# EasyEDA Pro project AAR.epro

# Schematic Schematic1
Board Name: Board1; Create Date: 2026-04-26; Page Name: P1; Project Name: AAR; Schematic Name: Schematic1; Update Date: 2026-04-26; Company: EasyEDA.com; Page Size: A4; Version: V1.0
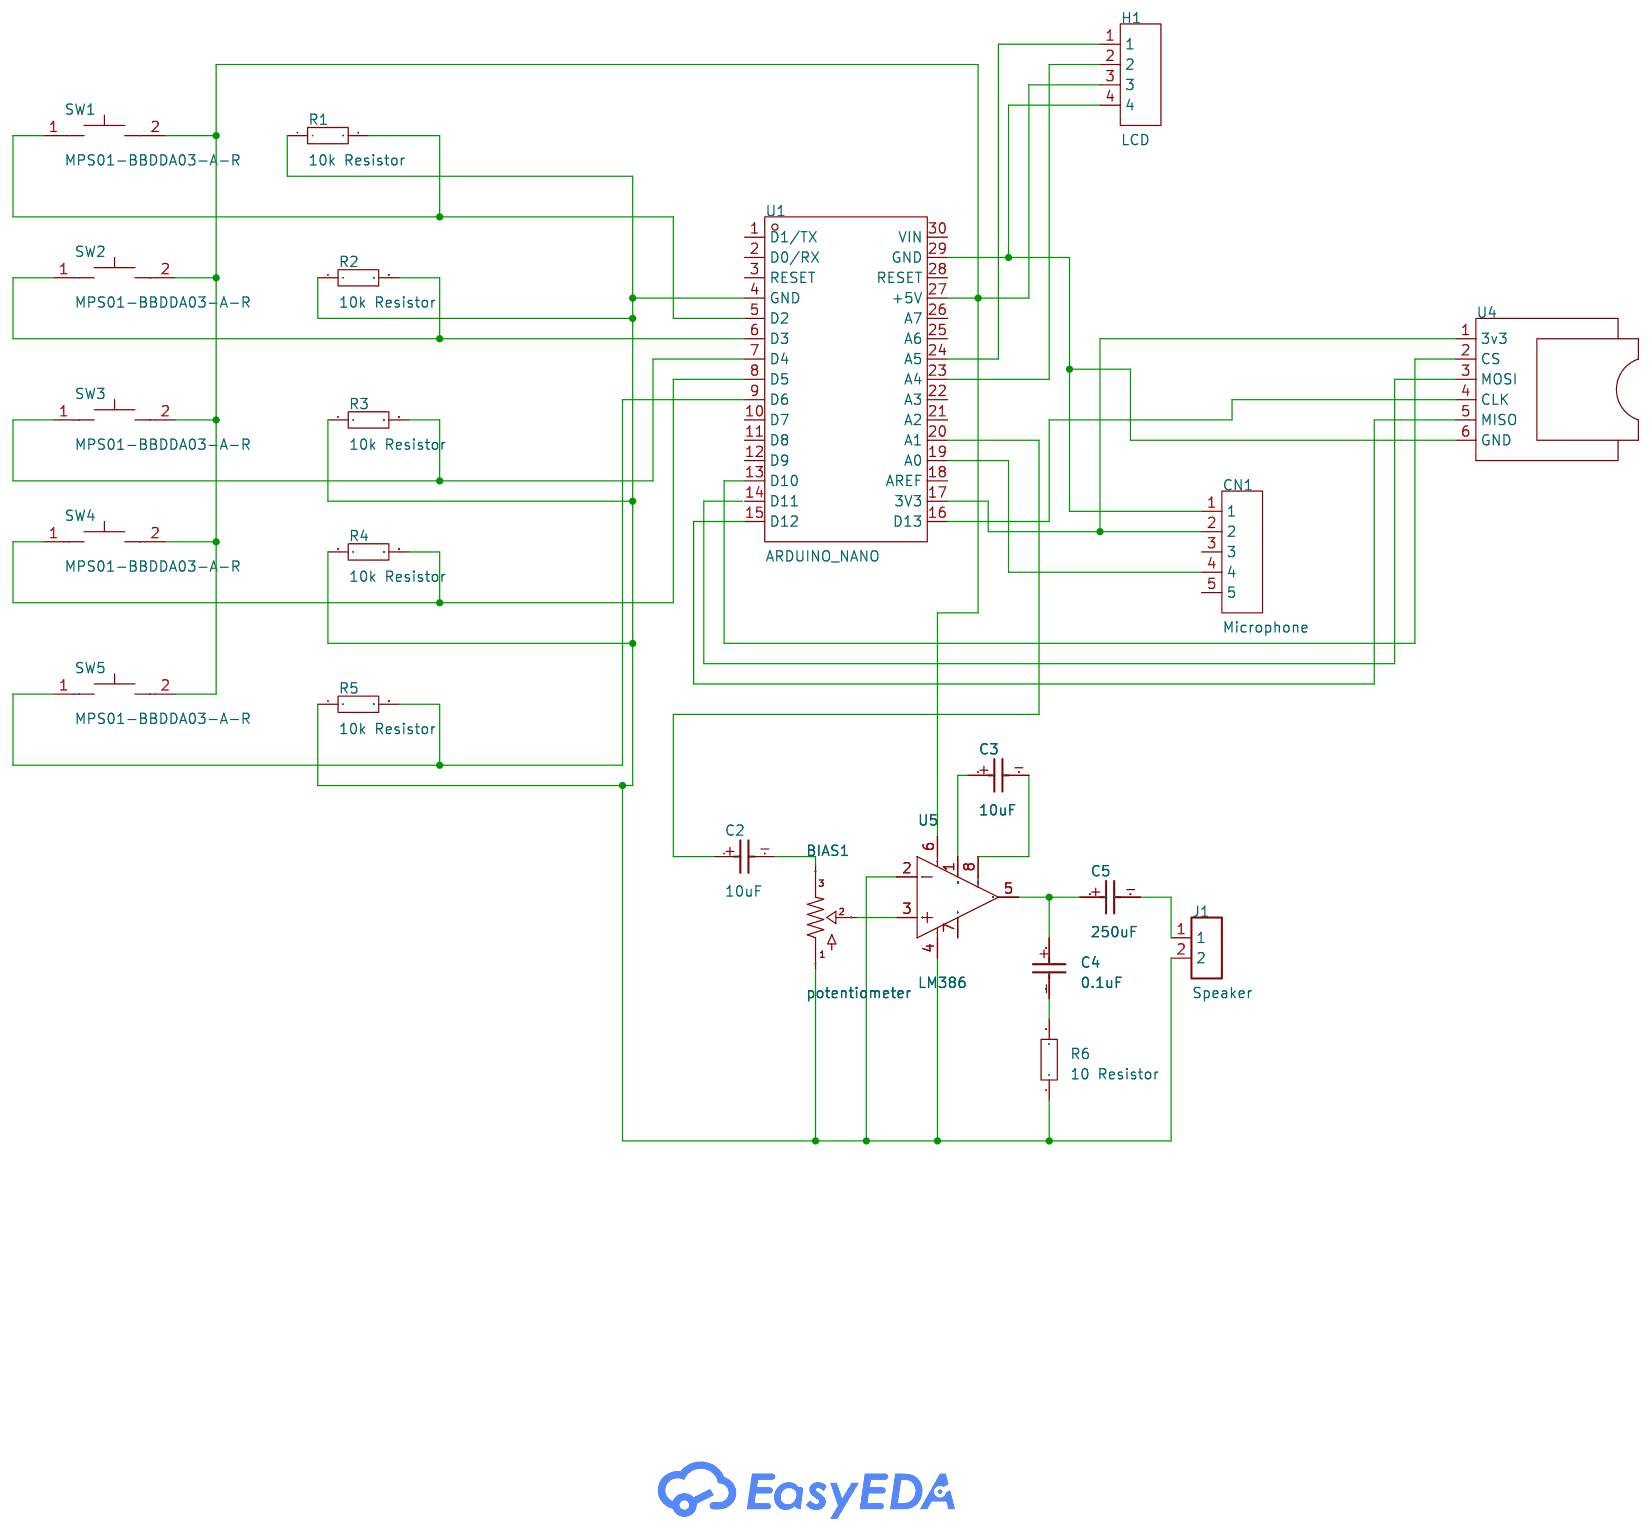
[diagram p0: schematic sheet]

## Parts
BIAS1  potentiometer  [TRIM1]
C2  10uF  [CAP-TH_L7.2-W2.5-P5.00-D0.5_224CL0016]
C3  10uF  [CAP-TH_L7.2-W2.5-P5.00-D0.5_224CL0016]
C4  0.1uF  [CAP-TH_L7.2-W2.5-P5.00-D0.5_224CL0016]
C5  250uF  [CAP-TH_L7.2-W2.5-P5.00-D0.5_224CL0016]
CN1  Microphone  [CONN-TH_5P-P1.25_C9900015777]
H1  LCD  [HDR-SMD_4P-P2.54_POGOPIN]
J1  Speaker  [JST-PH-2.0-2P]
R1  10k Resistor  [Resistor 1/8w 7mm metal film]
R2  10k Resistor  [Resistor 1/8w 7mm metal film]
R3  10k Resistor  [Resistor 1/8w 7mm metal film]
R4  10k Resistor  [Resistor 1/8w 7mm metal film]
R5  10k Resistor  [Resistor 1/8w 7mm metal film]
R6  10 Resistor  [Resistor 1/8w 7mm metal film]
SW1  MPS01-BBDDA03-A-R  [SW-TH_MPS01-BBDDA03-A-R]
SW2  MPS01-BBDDA03-A-R  [SW-TH_MPS01-BBDDA03-A-R]
SW3  MPS01-BBDDA03-A-R  [SW-TH_MPS01-BBDDA03-A-R]
SW4  MPS01-BBDDA03-A-R  [SW-TH_MPS01-BBDDA03-A-R]
SW5  MPS01-BBDDA03-A-R  [SW-TH_MPS01-BBDDA03-A-R]
U1  ARDUINO_NANO  [COMM-TH_ARDUINO_NANO]
U4  -  [MicroSD_Module]
U5  LM386  [DIP08]

## Library data of the parts
BIAS1 = potentiometers_TRIMMER_
C2-C5 = ESY108M035AL4AA: 1000microfarad Capacitor; Supplier: LCSC; Manufacturer Part: CL21B104KCFNNNE; Manufacturer: SAMSUNG(三星); Supplier Part: C28233; JLCPCB Part Class: Basic Part
CN1 = 按键接插件: Supplier Part: C9900015777; Supplier Footprint: 1.25mm-5pin弯针; JLCPCB Part Class: Extended Part; Supplier: LCSC
H1 = POGOPIN: Supplier Part: C9900020453; Supplier Footprint: 2.54-4Pin; JLCPCB Part Class: Extended Part; Supplier: LCSC
J1 = JST-PH-2.0-2P
R1-R6 = resistor: Supplier: LCSC; Manufacturer: UNI-ROYAL(Uniroyal Elec); Manufacturer Part: 1206W4F1002T5E; Supplier Part: C17902; Resistance: 10KΩ; JLCPCB Part Class: Basic Part; Datasheet: https://datasheet.lcsc.com/lcsc/2206010145_UNI-ROYAL-Uniroyal-Elec-1206W4F1002T5E_C17902.pdf
SW1-SW5 = MPS01-BBDDA03-A-R: LCSC Part Name: 按键开关; Supplier Part: C22462018; Manufacturer: Legion(六钧); Supplier Footprint: 插件; JLCPCB Part Class: Extended Part; Datasheet: https://item.szlcsc.com/datasheet/MPS01-BBDDA03-A-R/24145847.html; Supplier: LCSC
U1 = ARDUINO_NANO: Supplier Part: C9900017879; Supplier Footprint: 插件; JLCPCB Part Class: Extended Part; Supplier: LCSC
U4 = MicroSD Module
U5 = LM386

## Nets
$1N950: U1.13(D10) U4.2(CS)
$1N973: CN1.2 U1.17(3V3) U4.1(3v3)
$1N979: CN1.4 U1.19(A0)
$1N1016: H1.2 U1.23(A4)
$1N1025: H1.1 U1.24(A5)
$1N1064: R1.2 SW1.1 U1.5(D2)
$1N1072: R2.2 SW2.1 U1.6(D3)
$1N1078: R3.2 SW3.1 U1.7(D4)
$1N1089: R4.2 SW4.1 U1.8(D5)
$1N1097: R5.2 SW5.1 U1.9(D6)
$1N1236: BIAS1.1 J1.2 R1.1 R2.1 R3.1 R4.1 R5.1 R6.1 U1.4(GND) U5.2(-IN) U5.4(V-)
$1N2164: CN1.1 H1.4 U1.29(GND) U4.6(GND)
$1N2185: H1.3 SW1.2 SW2.2 SW3.2 SW4.2 SW5.2 U1.27(+5V) U5.6(V+)
$1N2208: U1.15(D12) U4.5(MISO)
$1N2254: U1.16(D13) U4.4(CLK)
$1N2642: BIAS1.2 U5.3(+IN)
$1N2646: BIAS1.3 C2.2
$1N2651: C4.1 C5.1 U5.5(OUT)
$1N2664: C4.2 R6.2
$1N2668: C3.1 U5.1(GAIN@1)
$1N2673: C3.2 U5.8(GAIN@8)
$1N2691: C5.2 J1.1
$1N2809: C2.1 U1.20(A1)

Not connected (* = marked no-connect by the designer): CN1 3 5; U1 1(D1/TX) 2(D0/RX) 3(RESET) 10(D7) 11(D8) 12(D9) 14(D11) 18(AREF) 21(A2) 22(A3) 25(A6) 26(A7) 28(RESET) 30(VIN); U4 3(MOSI); U5 7(BP)

# Board PCB1
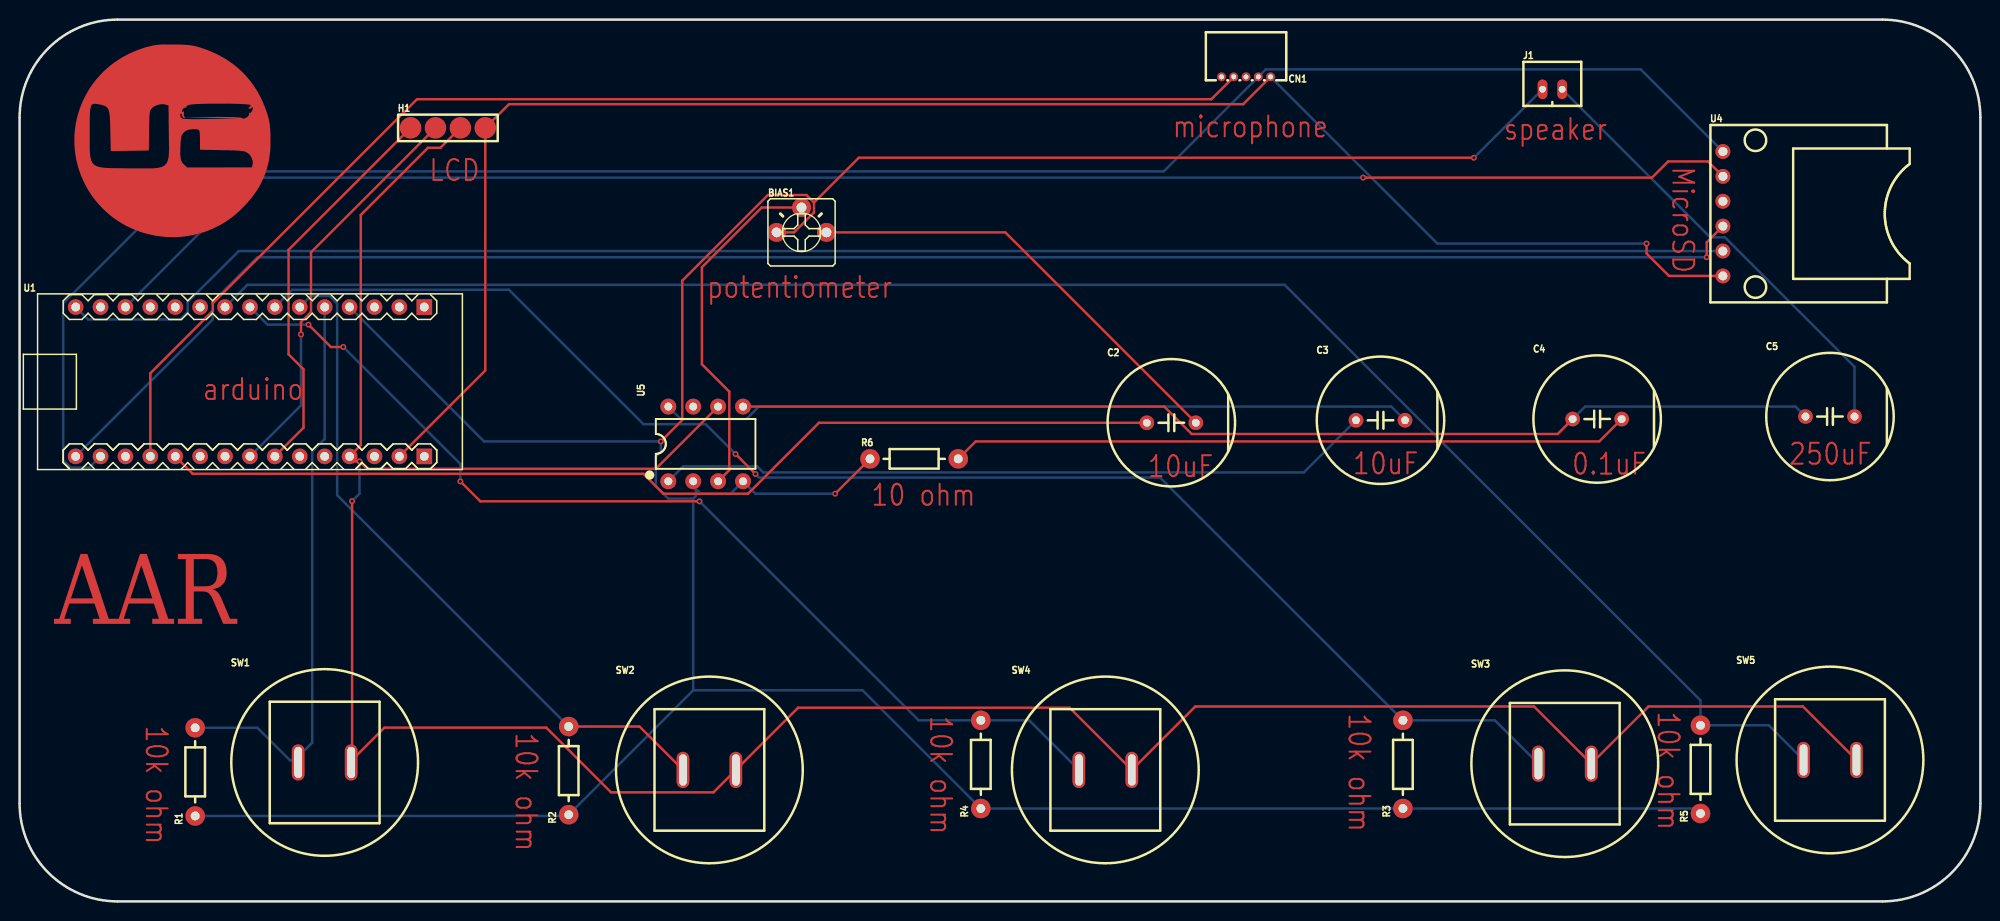
[diagram p1: board, top side]
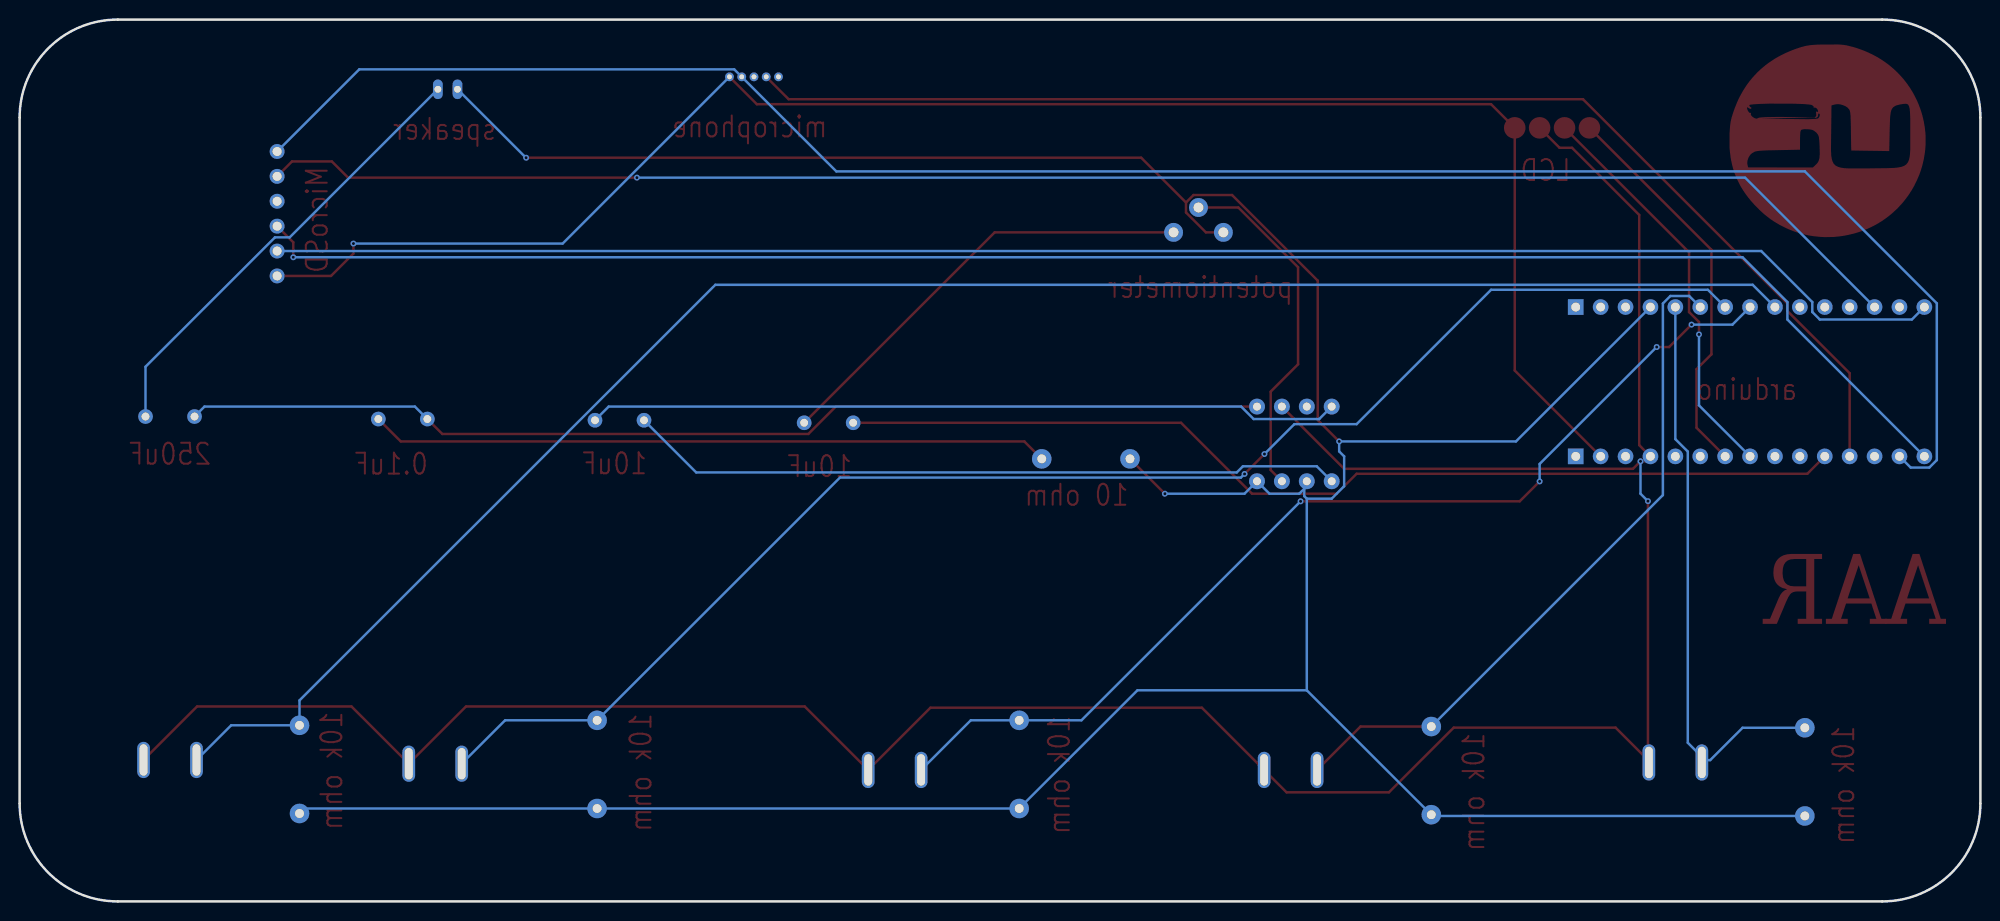
[diagram p2: board, bottom side, seen from below]

Outline 200 x 90 mm; copper layers: Top Layer, Bottom Layer. Coordinates in mm from the lower left corner of the outline.
Outline path: 0,80 0,10 arc(2.93,2.93) 10,0 190,0 arc(197.07,2.93) 200,10 200,80 arc(197.07,87.07) 190,90 10,90 arc(2.93,87.07) 0,80
Stack: Top Layer 0.035mm / Dielectric1 1.51mm FR4 er 4.5 / Bottom Layer 0.035mm

## Design rules (mm)
template: JLCPCB Capability(Two Layers Board)
spacing copperThickness1oz (default): track to track 0.102, other pairs 0.152 to 0.3
spacing copperThickness2oz: track to track 0.203, other pairs 0.152 to 0.3
track width copperThickness1oz (default): min 0.127, default 0.254, max 2.54
track width copperThickness2oz: min 0.203, default 0.254, max 2.54
differential pair differentialPair (default): width min 0.127, default 0.254, max 2.54; gap min 0.152, default 0.152
via viaSize (default): diameter min 0.5, default 0.61, max 10; hole min 0.3, default 0.305, max 6.3

## Placement (name value [footprint] x y rotation side)
BIAS1  potentiometer  [TRIM1]  79.76 68.28 0 top
C2  10uF  [CAP-TH_L7.2-W2.5-P5.00-D0.5_224CL0016]  117.47 48.85 0 top
C3  10uF  [CAP-TH_L7.2-W2.5-P5.00-D0.5_224CL0016]  138.81 49.11 0 top
C4  0.1uF  [CAP-TH_L7.2-W2.5-P5.00-D0.5_224CL0016]  160.91 49.23 0 top
C5  250uF  [CAP-TH_L7.2-W2.5-P5.00-D0.5_224CL0016]  184.66 49.49 0 top
CN1  Microphone  [CONN-TH_5P-P1.25_C9900015777]  125.09 84.16 180 top
H1  LCD  [HDR-SMD_4P-P2.54_POGOPIN]  43.69 78.95 0 top
J1  Speaker  [JST-PH-2.0-2P]  156.34 82.89 0 top
R1  10k Resistor  [Resistor 1/8w 7mm metal film]  17.91 8.72 90 top
R2  10k Resistor  [Resistor 1/8w 7mm metal film]  56.01 8.85 90 top
R3  10k Resistor  [Resistor 1/8w 7mm metal film]  141.1 9.48 90 top
R4  10k Resistor  [Resistor 1/8w 7mm metal film]  98.04 9.48 90 top
R5  10k Resistor  [Resistor 1/8w 7mm metal film]  171.45 8.97 90 top
R6  10 Resistor  [Resistor 1/8w 7mm metal film]  86.74 45.17 0 top
SW1  MPS01-BBDDA03-A-R  [SW-TH_MPS01-BBDDA03-A-R]  31.12 14.18 0 top
SW2  MPS01-BBDDA03-A-R  [SW-TH_MPS01-BBDDA03-A-R]  70.36 13.42 0 top
SW3  MPS01-BBDDA03-A-R  [SW-TH_MPS01-BBDDA03-A-R]  157.61 14.05 0 top
SW4  MPS01-BBDDA03-A-R  [SW-TH_MPS01-BBDDA03-A-R]  110.74 13.42 0 top
SW5  MPS01-BBDDA03-A-R  [SW-TH_MPS01-BBDDA03-A-R]  184.66 14.44 0 top
U1  ARDUINO_NANO  [COMM-TH_ARDUINO_NANO]  23.49 53.04 0 top
U4  -  [MicroSD_Module]  180.09 68.92 0 top
U5  LM386  [DIP08]  69.98 46.69 0 top

## Footprints (pads in the part's own frame, mm; a bottom-side part is the same pattern mirrored in y, then rotated)
CAP-TH_L7.2-W2.5-P5.00-D0.5_224CL0016
  round 1.5 hole 0.8: 1(-2.5,0) 2(2.5,0)
COMM-TH_ARDUINO_NANO
  rect 1.6x1.6 hole 0.9: 1(17.78,7.62) 30(17.78,-7.62)
  round 1.6 hole 0.9: 2(15.24,7.62) 3(12.7,7.62) 4(10.16,7.62) 5(7.62,7.62) 6(5.08,7.62) 7(2.54,7.62) 8(0,7.62) 9(-2.54,7.62) 10(-5.08,7.62) 11(-7.62,7.62) 12(-10.16,7.62) 13(-12.7,7.62) 14(-15.24,7.62) 15(-17.78,7.62) 16(-17.78,-7.62) 17(-15.24,-7.62) 18(-12.7,-7.62) 19(-10.16,-7.62) 20(-7.62,-7.62) 21(-5.08,-7.62) 22(-2.54,-7.62) 23(0,-7.62) 24(2.54,-7.62) 25(5.08,-7.62) 26(7.62,-7.62) 27(10.16,-7.62) 28(12.7,-7.62) 29(15.24,-7.62)
CONN-TH_5P-P1.25_C9900015777
  round 0.9 hole 0.5: 1(-2.5,0) 2(-1.25,0) 3(0,0) 4(1.25,0) 5(2.5,0)
DIP08
  round 1.625 hole 0.813: 1(-3.81,-3.81) 2(-1.27,-3.81) 3(1.27,-3.81) 4(3.81,-3.81) 5(3.81,3.81) 6(1.27,3.81) 7(-1.27,3.81) 8(-3.81,3.81)
HDR-SMD_4P-P2.54_POGOPIN
  round 2.2 smd: 1(-3.81,0) 2(-1.27,0) 3(1.27,0) 4(3.81,0)
JST-PH-2.0-2P
  oval 1x2 hole 0.7: 1(1,0) 2(-1,0)
MicroSD_Module
  round 1.524 hole 0.914: 1(-6.35,7.62) 2(-6.35,5.08) 3(-6.35,2.54) 4(-6.35,0) 5(-6.35,-2.54) 6(-6.35,-5.08)
Resistor 1/8w 7mm metal film
  round 2 hole 0.9: 1(0,0) 2(9,0)
SW-TH_MPS01-BBDDA03-A-R
  oval 1.3x3.7 hole 0.8x3.2: 1(-2.7,0) 2(2.7,0)
TRIM1
  round 1.931 hole 1: 1(-2.54,0) 2(0,2.54) 3(2.54,0)

## Nets
As in the schematic.

Pads without a net: CN1 3 5; U1 1 2 3 10 11 12 14 18 21 22 25 26 28 30; U5 7

## Via types
v1: diameter 0.61, hole 0.305, Top Layer to Bottom Layer, 15 vias

## Routing (per net, layer and track width the routed paths; a pad name or vN(x,y) marks a point on that pad's centre or on a via; arc(x,y) is an arc through that point)
$1N950: length 169.7
  Top Layer w0.254: U4.2 172.21,75.52 168.15,75.52 166.5,73.87 v1(137.03,73.87)
  Bottom Layer w0.254: U1.13 24,73.87 v1(137.03,73.87)
$1N973: length 203.3
  Bottom Layer w0.254: U4.1 165.35,84.92 127.11,84.92 CN1.2 116.69,74.51 17.91,74.51 4.44,61.04 4.44,45.04 5.21,44.28 7.11,44.28 U1.17
$1N979: length 132
  Top Layer w0.254: U1.19 13.33,53.91 19.7,60.28 19.7,61.04 40.53,81.87 121.56,81.87 CN1.4
$1N1016: length 41.4
  Top Layer w0.254: v1(28.7,57.87) 28.7,59.14 29.72,60.16 29.72,66.25 H1.2
  Bottom Layer w0.254: U1.23 28.7,50.63 v1(28.7,57.87)
$1N1025: length 40.5
  Top Layer w0.254: H1.1 27.43,66.51 27.43,55.84 28.96,54.31 28.96,48.34 U1.24
$1N1064: length 59.5
  Bottom Layer w0.254: 28.07,14.42 27.56,14.42 24.26,17.72 R1.2 ; 28.07,14.42 28.18,14.42 SW1.1 ; 28.07,14.42 29.84,16.2 29.84,45.91 31.12,47.18 U1.5
$1N1072: length 71
  Top Layer w0.254: SW2.1 63.23,17.85 R2.2
  Bottom Layer w0.254: R2.2 32.38,41.47 32.38,61.03 31.62,61.79 29.7,61.79 U1.6
$1N1078: length 149.6
  Top Layer w0.254: v1(75.06,43.63) v1(73.03,45.66)
  Bottom Layer w0.254: v1(75.06,43.63) 75.43,43.26 116.32,43.26 R3.2 150.48,18.48 SW3.1 ; U1.7 27.8,62.42 49.91,62.42 63.63,48.71 69.98,48.71 v1(73.03,45.66)
$1N1089: length 105.2
  Top Layer w0.254: v1(33.02,56.58) 31.75,56.58 v1(29.46,58.87) ; v1(69.34,40.83) 46.99,40.83 v1(44.96,42.87)
  Bottom Layer w0.254: v1(29.46,58.87) 25.29,58.87 U1.8 ; v1(33.02,56.58) 44.96,44.64 v1(44.96,42.87) ; v1(69.34,40.83) 91.69,18.48 R4.2 102.98,18.48 SW4.1
$1N1097: length 183.5
  Bottom Layer w0.254: U1.9 23.22,62.93 129.03,62.93 171.45,20.51 R5.2 178.42,17.97 SW5.1
$1N1236: length 372.1
  Top Layer w0.254: v1(65.41,46.95) 67.59,49.13 67.59,63.36 76.33,72.09 80.26,72.09 81.03,71.33 ; 81.03,71.33 85.6,75.9 v1(148.34,75.9) ; 81.03,71.33 81.03,70.31 78.99,68.28 BIAS1.1 ; v1(83.19,41.61) R6.1
  Bottom Layer w0.254: 68.96,42.12 68.96,42.63 U5.2 ; 68.96,42.12 68.96,41.36 68.71,41.11 ; 68.96,42.12 69.47,41.61 72.52,41.61 U5.4 75.06,41.61 v1(83.19,41.61) ; 68.71,41.11 66.17,41.11 64.9,42.38 64.9,45.42 65.41,45.93 v1(65.41,46.95) 47.37,46.95 U1.4 ; 68.71,41.11 68.71,21.55 ; 68.71,21.55 85.98,21.55 R4.1 R3.1 170.94,9.48 R5.1 ; 68.71,21.55 R2.1 55.88,8.72 R1.1 ; J1.2 148.35,75.9 v1(148.34,75.9)
$1N2164: length 174.6
  Top Layer w0.254: U1.29 47.5,54.19 H1.4 49.91,81.36 124.8,81.36 CN1.1 ; U4.6 168.23,63.84 165.95,66.12 v1(165.95,67.14)
  Bottom Layer w0.254: CN1.1 144.61,67.14 v1(165.95,67.14)
$1N2185: length 284.3
  Top Layer w0.254: SW5.2 181.9,19.9 166.15,19.9 SW3.2 154.47,19.9 119.92,19.9 SW4.2 107.09,19.77 79.41,19.77 SW2.2 70.77,11.13 60.32,11.13 53.72,17.74 37.21,17.74 33.91,14.44 ; H1.3 42.93,76.92 41.66,76.92 34.8,70.06 34.8,46.57 U1.27 34.16,44.92 v1(34.67,44.92) 35.43,44.15 64.9,44.15 U5.6 ; SW1.2 33.91,14.28 33.91,14.44 ; 33.91,14.44 v1(33.91,40.85)
  Bottom Layer w0.254: v1(33.91,40.85) 34.67,41.61 v1(34.67,44.92)
$1N2208: length 172
  Bottom Layer w0.254: U4.5 22.35,66.38 17.14,61.17 17.14,60.16 16.38,59.39 6.98,59.39 U1.15
$1N2254: length 179.7
  Top Layer w0.254: U4.4 172.08,67.27 v1(172.08,65.74)
  Bottom Layer w0.254: U1.16 19.68,59.39 19.68,61.17 24.26,65.74 v1(172.08,65.74)
$1N2642: length 36.2
  Top Layer w0.254: U5.3 72.39,44.03 72.39,52.03 69.6,54.82 69.6,64.73 75.69,70.82 BIAS1.2
$1N2646: length 45.7
  Top Layer w0.254: BIAS1.3 100.54,68.28 C2.2
$1N2651: length 111.1
  Top Layer w0.254: C4.1 156.88,47.71 119.55,47.71 116.75,50.5 U5.5
  Bottom Layer w0.254: C5.1 181.14,50.5 159.68,50.5 C4.1
$1N2664: length 69.4
  Top Layer w0.254: C4.2 161.12,46.95 97.52,46.95 R6.2
$1N2668: length 73.2
  Bottom Layer w0.254: C3.1 130.99,43.78 75.85,43.78 75.22,44.41 67.69,44.41 U5.1
$1N2673: length 76.8
  Bottom Layer w0.254: U5.8 67.44,49.23 74.13,49.23 75.4,50.5 139.91,50.5 C3.2
$1N2691: length 46.6
  Bottom Layer w0.254: C5.2 187.16,54.57 173.95,67.78 172.45,67.78 J1.1
$1N2809: length 103.7
  Top Layer w0.254: C2.1 81.53,48.85 74.29,41.61 65.66,41.61 63.63,43.65 17.65,43.65 U1.20

Small or netless copper shapes (teardrops, artwork), in the pictures only: 1 on Top Layer

## Text on the board
Top Layer: arduino | LCD | potentiometer | 10 ohm | 10uF | microphone | speaker | 0.1uF | 250uF | 10k ohm | MicroSD | AAR
